# EAGLE schematic main (EAGLE 6.1)
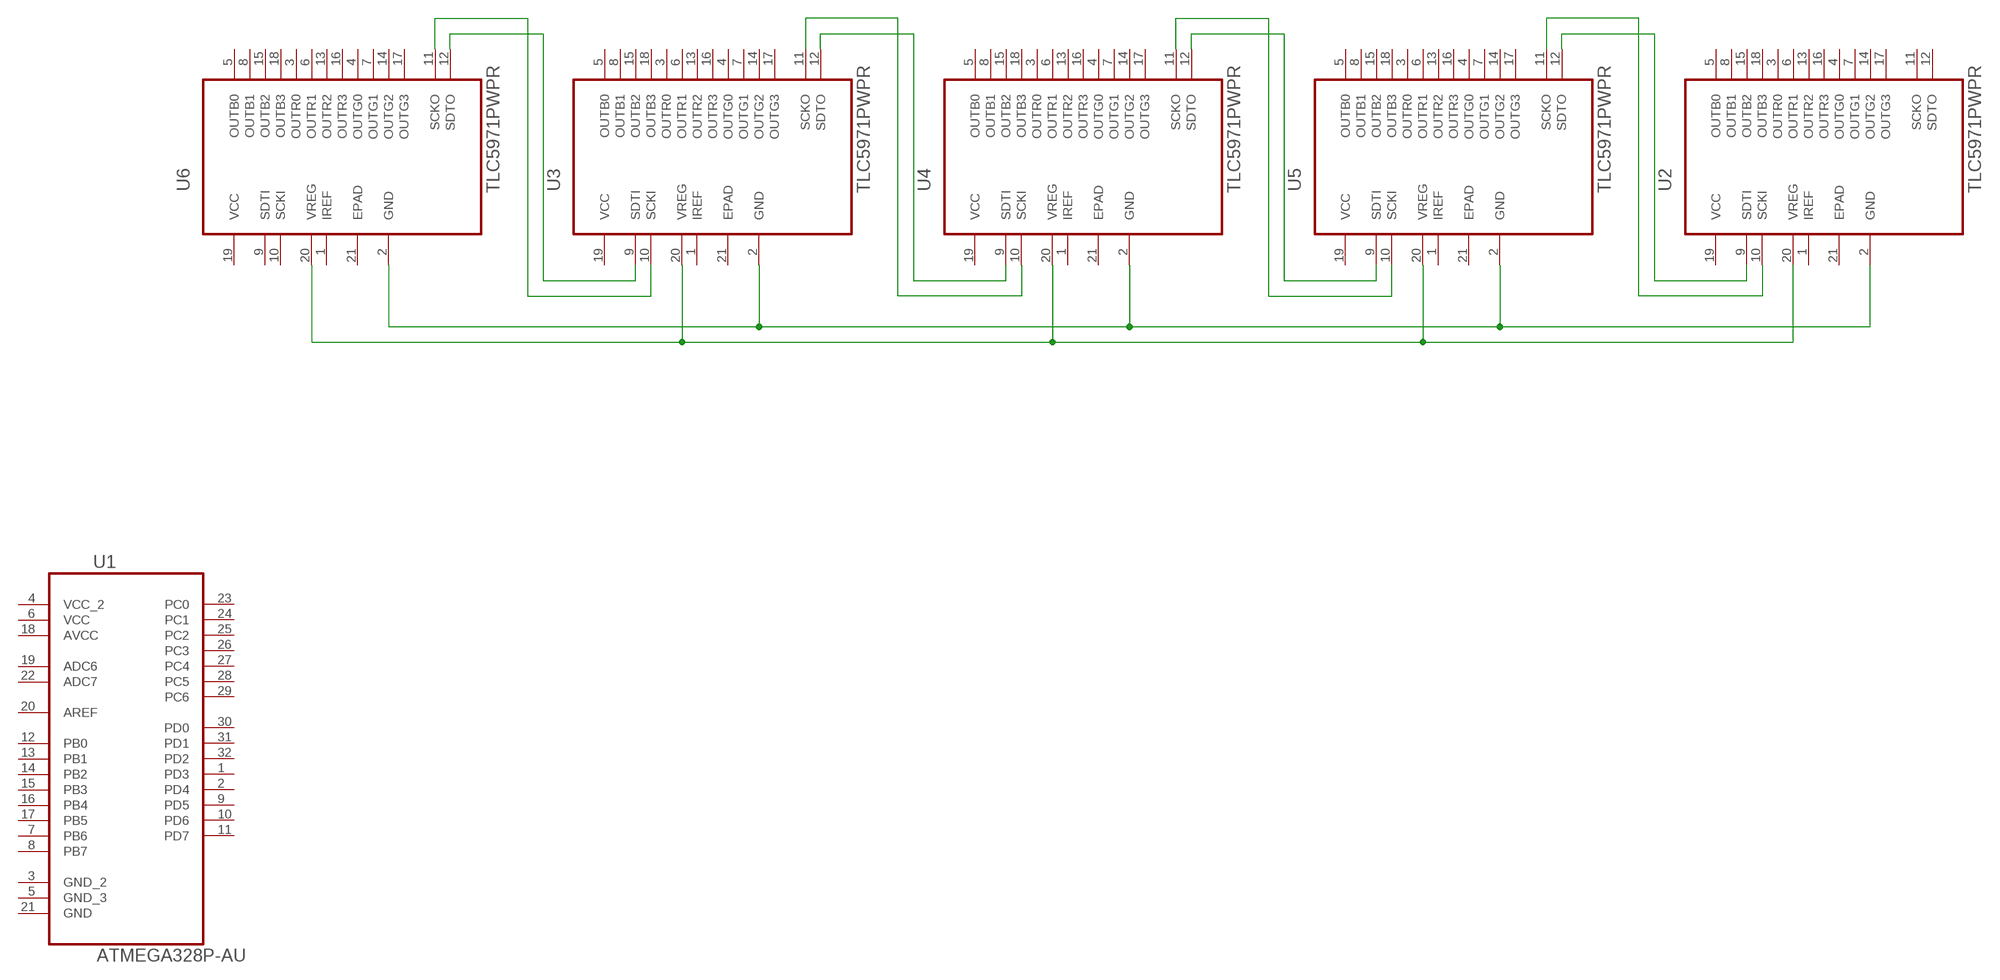
[diagram p0: schematic, sheet 1]

## Parts
U1  ATMEGA328P-AU  [QFP80P900X900X120-32N]
U2  TLC5971PWPR  [SOP65P640X120-21N]
U3  TLC5971PWPR  [SOP65P640X120-21N]
U4  TLC5971PWPR  [SOP65P640X120-21N]
U5  TLC5971PWPR  [SOP65P640X120-21N]
U6  TLC5971PWPR  [SOP65P640X120-21N]

## Nets
N$1: U2.20(VREG) U3.20(VREG) U4.20(VREG) U5.20(VREG) U6.20(VREG)
N$2: U2.2(GND) U3.2(GND) U4.2(GND) U5.2(GND) U6.2(GND)
N$3: U3.9(SDTI) U6.12(SDTO)
N$4: U3.10(SCKI) U6.11(SCKO)
N$5: U3.12(SDTO) U4.9(SDTI)
N$6: U3.11(SCKO) U4.10(SCKI)
N$7: U4.12(SDTO) U5.9(SDTI)
N$8: U4.11(SCKO) U5.10(SCKI)
N$9: U2.9(SDTI) U5.12(SDTO)
N$10: U2.10(SCKI) U5.11(SCKO)
Unconnected: U1.1(PD3) U1.2(PD4) U1.3(GND_2) U1.5(GND_3) U1.7(PB6) U1.8(PB7) U1.9(PD5) U1.10(PD6) U1.11(PD7) U1.12(PB0) U1.13(PB1) U1.14(PB2) U1.15(PB3) U1.16(PB4) U1.17(PB5) U1.19(ADC6) U1.20(AREF) U1.21(GND) U1.22(ADC7) U1.23(PC0) U1.24(PC1) U1.25(PC2) U1.26(PC3) U1.27(PC4) U1.28(PC5) U1.29(PC6) U1.30(PD0) U1.31(PD1) U1.32(PD2) U2.1(IREF) U2.3(OUTR0) U2.4(OUTG0) U2.5(OUTB0) U2.6(OUTR1) U2.7(OUTG1) U2.8(OUTB1) U2.11(SCKO) U2.12(SDTO) U2.13(OUTR2) U2.14(OUTG2) U2.15(OUTB2) U2.16(OUTR3) U2.17(OUTG3) U2.18(OUTB3) U2.21(EPAD) U3.1(IREF) U3.3(OUTR0) U3.4(OUTG0) U3.5(OUTB0) U3.6(OUTR1) U3.7(OUTG1) U3.8(OUTB1) U3.13(OUTR2) U3.14(OUTG2) U3.15(OUTB2) U3.16(OUTR3) U3.17(OUTG3) U3.18(OUTB3) U3.21(EPAD) U4.1(IREF) U4.3(OUTR0) U4.4(OUTG0) U4.5(OUTB0) U4.6(OUTR1) U4.7(OUTG1) U4.8(OUTB1) U4.13(OUTR2) U4.14(OUTG2) U4.15(OUTB2) U4.16(OUTR3) U4.17(OUTG3) U4.18(OUTB3) U4.21(EPAD) U5.1(IREF) U5.3(OUTR0) U5.4(OUTG0) U5.5(OUTB0) U5.6(OUTR1) U5.7(OUTG1) U5.8(OUTB1) U5.13(OUTR2) U5.14(OUTG2) U5.15(OUTB2) U5.16(OUTR3) U5.17(OUTG3) U5.18(OUTB3) U5.21(EPAD) U6.1(IREF) U6.3(OUTR0) U6.4(OUTG0) U6.5(OUTB0) U6.6(OUTR1) U6.7(OUTG1) U6.8(OUTB1) U6.9(SDTI) U6.10(SCKI) U6.13(OUTR2) U6.14(OUTG2) U6.15(OUTB2) U6.16(OUTR3) U6.17(OUTG3) U6.18(OUTB3) U6.21(EPAD)

## Power pins joined to a net without a drawn wire
AVCC: U1.18(AVCC)
VCC: U1.6(VCC) U2.19(VCC) U3.19(VCC) U4.19(VCC) U5.19(VCC) U6.19(VCC)
VCC_2: U1.4(VCC_2)

## Library data of the parts
U1 = Atmel_By_element14_Batch_1-00:ATMEGA328P-AU: 8-bit Microcontroller with In-System Programmable Flash; MPN: ATMEGA328P-AU; OC_FARNELL: 1715486; OC_NEWARK: 14R4631; PACKAGE: TQFP-32; SUPPLIER: Atmel
U2-U6 = Texas Instruments_By_element14_Batch_1:TLC5971PWPR: Linear Regulator; MPN: TLC5971PWPR; OC_FARNELL: -; OC_NEWARK: 01T0730; PACKAGE: HTSSOP-20; SUPPLIER: TEXAS INSTRUMENTS